# EAGLE design Headphone-Amplifier-ClassAB-alt (EAGLE 7.2.0)
4x4 - Three Transistor Headphone Amplifier - Class AB http://www.electronics-diy.com/4x4.php
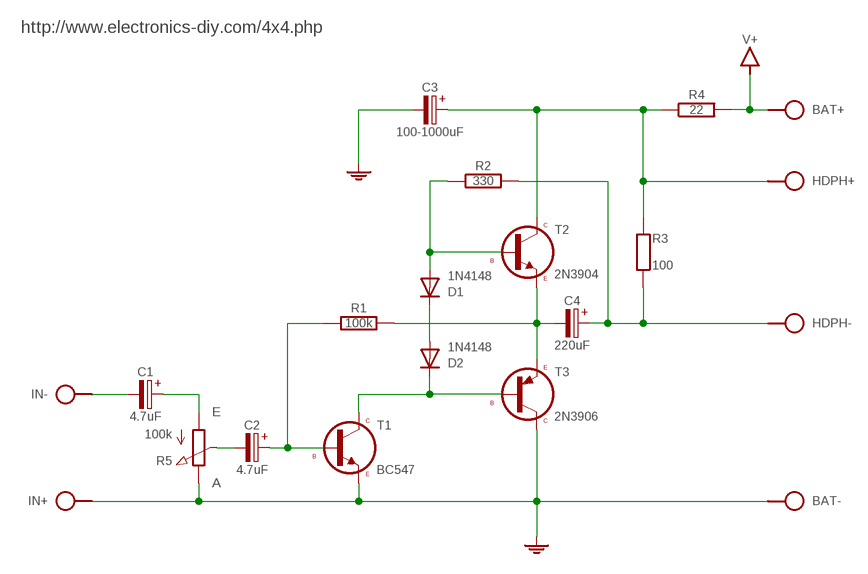
[diagram p0: schematic, sheet 1]

## Parts
BAT  SPAD+-+-  [SPAD+-]
C1  4.7uF  CPOLE2,5-3  [E2,5-3]
C2  4.7uF  CPOLE2,5-3  [E2,5-3]
C3  100-1000uF  CPOLE2,5-4/V  [E2.5-4/V]
C4  220uF  CPOLE5-4  [E5-4]
D1  1N4148  DIODE34-5-V  [DO34-5-V]
D2  1N4148  DIODE34-5V  [DO34-5V]
HDPH  SPAD+--+  [SPAD-+]
IN  SPAD+-+-  [SPAD+-]
R1  100k  R-H0204/10  [0204/10]
R2  330  R-H0204/10  [0204/10]
R3  100  R0204/10  [0204/10]
R4  22  R-H0204/10  [0204/10]
R5  100k  POT-3P  [CONN-3P]
T1  BC547  2N3904  [TO92]
T2  2N3904  [TO92]
T3  2N3906  [TO92]

## Nets
GND: BAT.1 C3.- IN.2 R5.3(E) T1.1(E) T3.3(C)
N$1: D1.A R2.1 T2.2(B)
N$2: D2.C T1.3(C) T3.2(B)
N$3: D1.C D2.A
N$5: C1.+ R5.1(A)
N$6: C2.- R5.2(S)
N$7: C2.+ R1.1 T1.2(B)
N$8: C3.+ HDPH.2 R3.1 R4.1 T2.3(C)
N$9: C4.+ HDPH.1 R2.2 R3.2
N$10: C1.- IN.1
T3: C4.- R1.2 T2.1(E) T3.1(E)
V+: BAT.2 R4.2

## Notes on the sheet
- http://www.electronics-diy.com/4x4.php

## Library data of the parts
BAT HDPH IN = pad:SPAD+-
C1-C4 = c:CPOL: POLARIZED CAPACITOR, European symbol
D1 D2 = d:DIODE
R1 R2 R4 = r:R-H
R3 = r:R: RESISTOR, European symbol
R5 = r:POT
T1 T2 = t:2N3904
T3 = t:2N3906

## Board
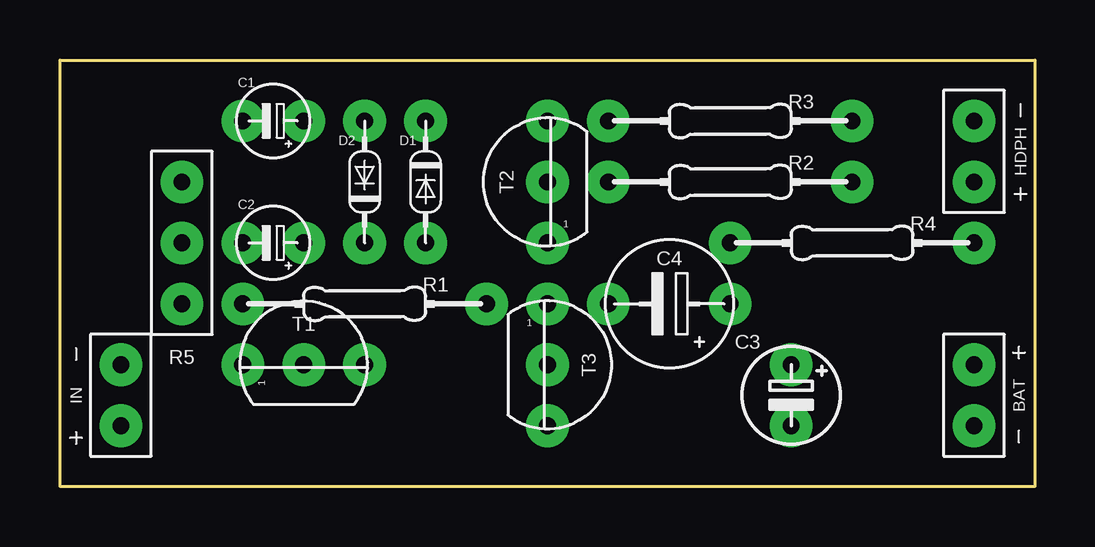
[diagram p1: board, top side]
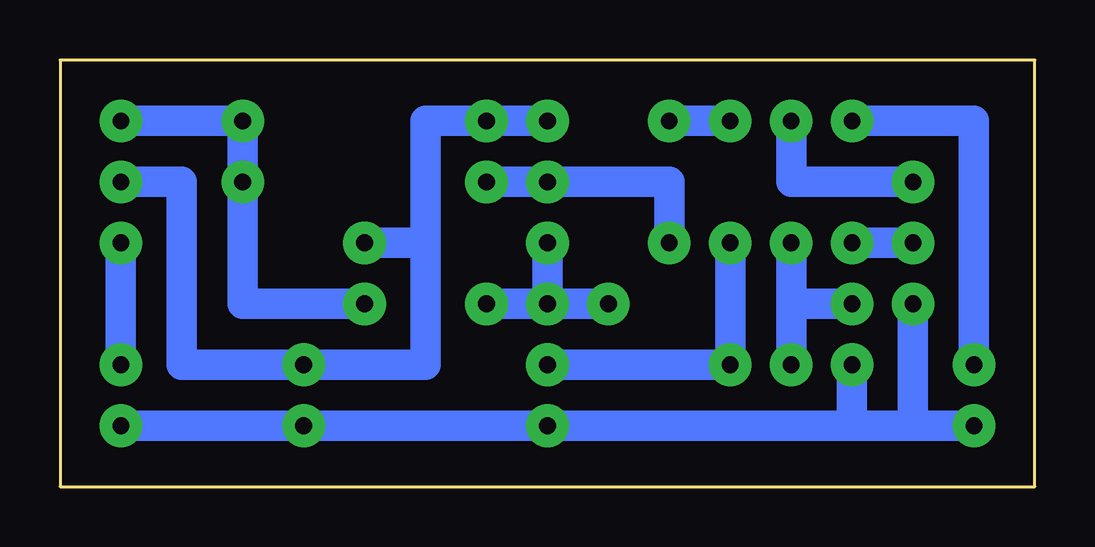
[diagram p2: board, bottom side, seen from below]

Size 40.64 x 17.78 mm. Coordinates in mm from the lower left corner, seen from the top.
Outline: 0,0 0,17.78 40.64,17.78 40.64,0 0,0
Copper layers (1*16): Top 0.035mm / dielectric 1.5mm / Bottom 0.035mm
Design rules "default": minimum track width 10mil, minimum drill 24mil, track to track 8mil, track to pad 8mil, pad to pad 8mil, via to via 8mil, smd to smd 8mil, copper to edge 40mil, drill to drill 8mil, minimum pad ring 10mil, minimum via ring 8mil, stop-mask expansion 4mil, vias tented up to drill 0mil, thermal gap 10mil

### Footprints (pad centres in the part's own frame; a part is rotated, then mirrored left to right if it is on the bottom)
SPAD+- = drill 0.7 pad 1.778: 1 0,-1.27; 2 0,1.27
E2,5-3 = drill 0.7 pad 1.778: + -1.27,0; - 1.27,0
E2.5-4/V = drill 0.7 pad 1.778: + 0,1.27; - 0,-1.27
E5-4 = drill 0.7 pad 1.778: + -2.54,0; - 2.54,0
DO34-5-V = drill 0.7 pad 1.778: A 0,-2.54; C 0,2.54
DO34-5V = drill 0.7 pad 1.778: A 0,2.54; C 0,-2.54
SPAD-+ = drill 0.7 pad 1.778: 1 0,-1.27; 2 0,1.27
0204/10 = drill 0.7 pad 1.778: 1 -5.08,0; 2 5.08,0
CONN-3P = drill 0.7 pad 1.778: 1 0,-2.54; 2 0,0; 3 0,2.54
TO92 = drill 0.7 pad 1.778: 1 0,2.54; 2 0,0; 3 0,-2.54

### Placement (x,y rotation side)
BAT  38.1,3.81 0 top
C1  8.89,15.24 180 top
C2  8.89,10.16 180 top
C3  30.48,3.81 0 top
C4  25.4,7.62 180 top
D1  15.24,12.7 0 top
D2  12.7,12.7 0 top
HDPH  38.1,13.97 180 top
IN  2.54,3.81 180 top
R1  12.7,7.62 0 top
R2  27.94,12.7 0 top
R3  27.94,15.24 0 top
R4  33.02,10.16 0 top
R5  5.08,10.16 180 top
T1  10.16,5.08 90 top
T2  20.32,12.7 180 top
T3  20.32,5.08 0 top

### Tracks (layer width: path | path; a pad name or v marks a point on that pad's centre or on a via)
GND
  Bottom 1.27: IN.2 5.08,2.54 | 7.62,2.54 T3.3 C3.- BAT.1 | T1.1 7.62,2.54 | 7.62,2.54 5.08,2.54 | 5.08,2.54 R5.3
N$1
  Bottom 1.27: R2.1 T2.2 15.24,12.7 D1.A
N$2
  Bottom 1.27: T3.2 T1.3 D2.C
N$3
  Bottom 1.27: D2.A D1.C
N$5
  Bottom 1.27: C1.+ 10.16,12.7 R5.1
N$6
  Bottom 1.27: C2.- R5.2
N$7
  Bottom 1.27: C2.+ 10.16,7.62 | 10.16,7.62 T1.2 | R1.1 10.16,7.62
N$8
  Bottom 1.27: 25.4,10.16 25.4,5.08 C3.+ 35.56,5.08 35.56,12.7 HDPH.2 | R4.1 25.4,10.16 | 25.4,10.16 25.4,15.24 R3.1 T2.3
N$9
  Bottom 1.27: C4.+ 33.02,7.62 R2.2 R3.2 HDPH.1
N$10
  Bottom 1.27: IN.1 2.54,15.24 C1.-
T3
  Bottom 1.27: C4.- T3.1 | T2.1 T3.1 | R1.2 T3.1
V+
  Bottom 1.27: BAT.2 R4.2